# EAGLE design power_supply (EAGLE 9.0.1)
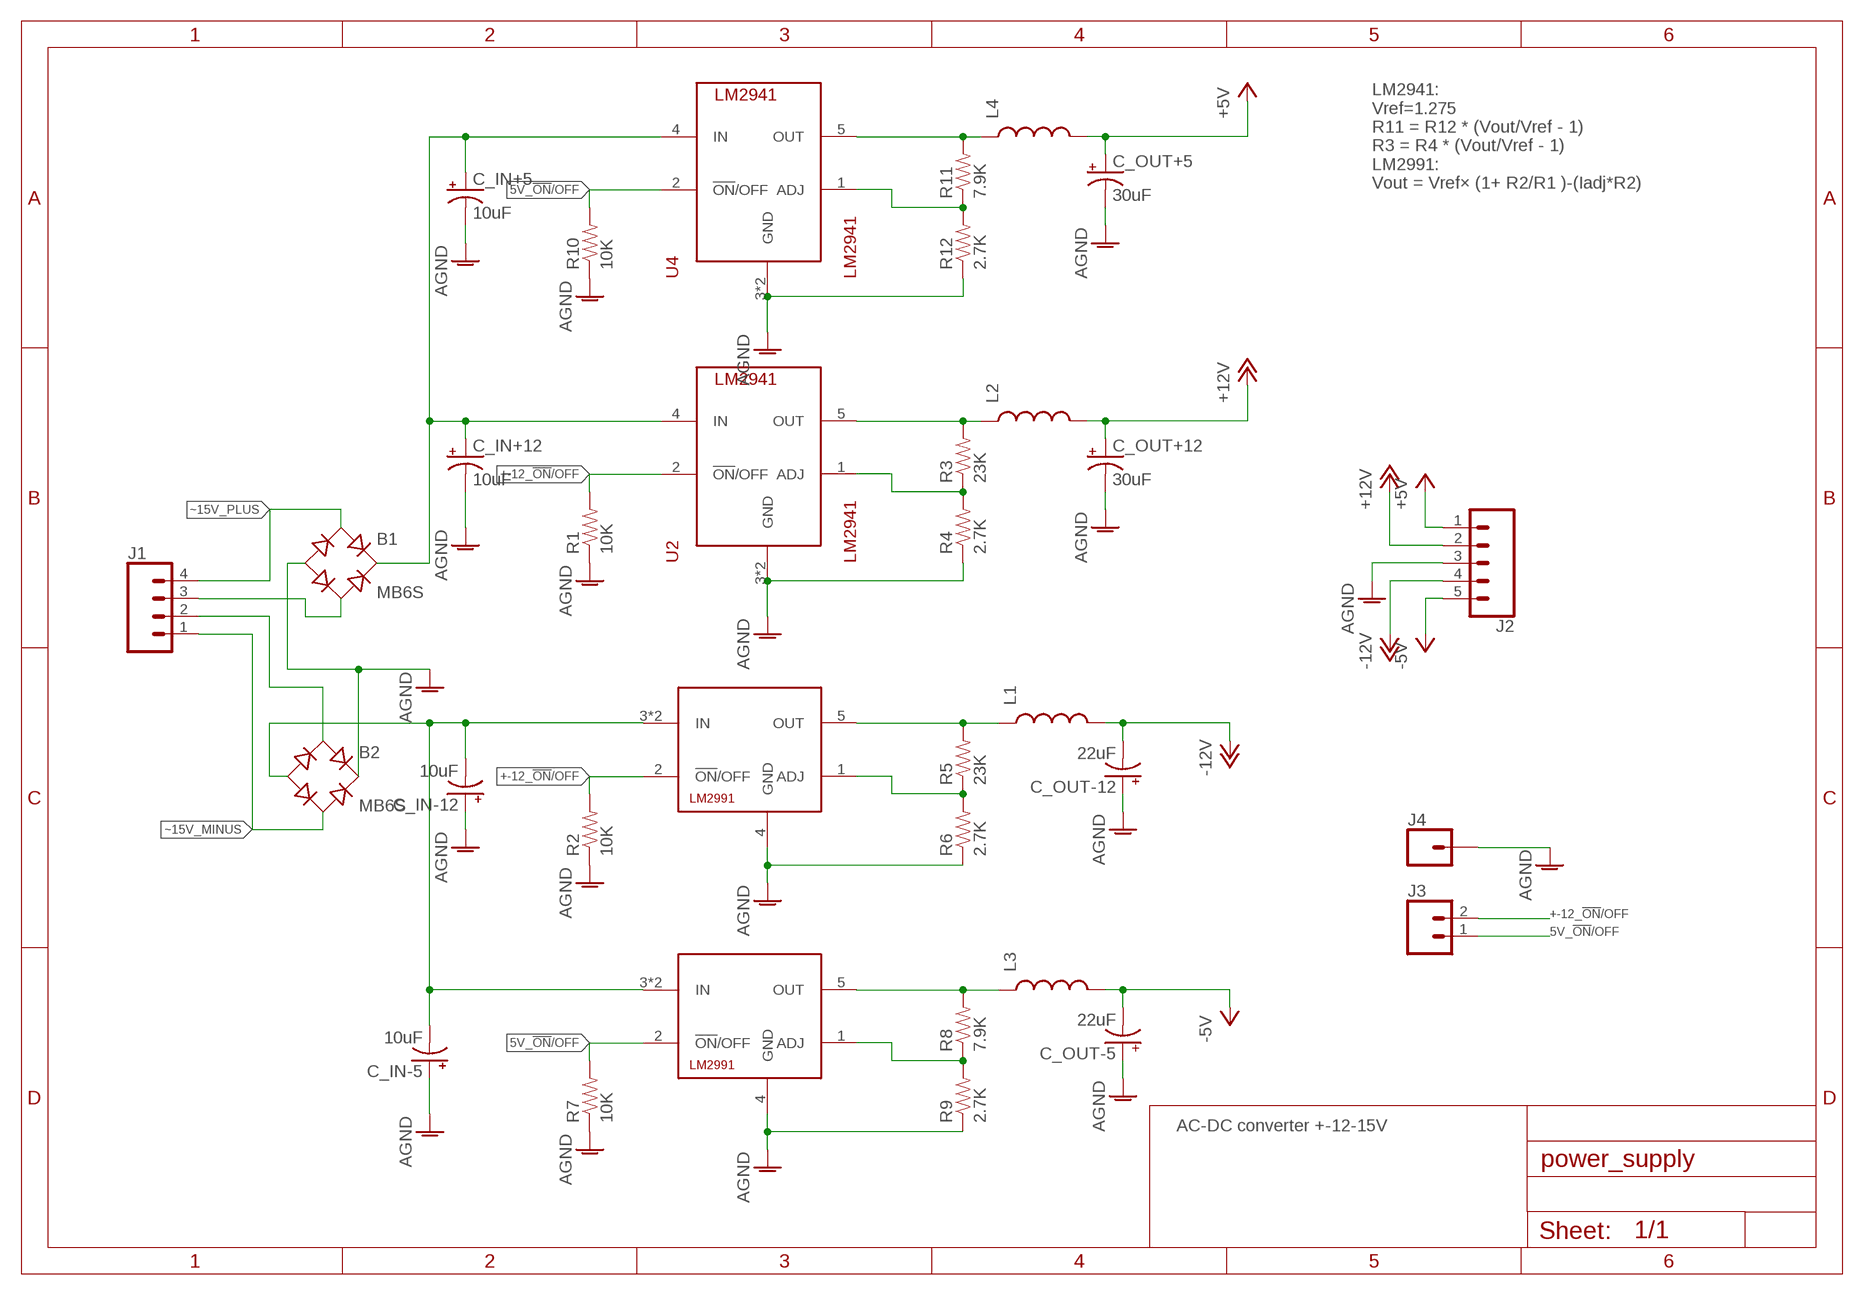
[diagram p0: schematic, sheet 1]

## Parts
B1  MB6S  [SOIC-4]
B2  MB6S  [SOIC-4]
C_IN+5  10uF  CAP_POL1206  [EIA3216]
C_IN+12  10uF  CAP_POL1206  [EIA3216]
C_IN-5  10uF  CAP_POL1206  [EIA3216]
C_IN-12  10uF  CAP_POL1206  [EIA3216]
C_OUT+5  30uF  CAP_POLPTH1  [CPOL-RADIAL-100UF-25V]
C_OUT+12  30uF  CAP_POLPTH1  [CPOL-RADIAL-100UF-25V]
C_OUT-5  22uF  CAP_POLPTH1  [CPOL-RADIAL-100UF-25V]
C_OUT-12  22uF  CAP_POLPTH1  [CPOL-RADIAL-100UF-25V]
J1  CONN_04LONGPADS  [1X04_LONGPADS]
J2  CONN_05PTH_LONGPADS  [1X05_LONGPADS]
J3  CONN_02POLAR  [MOLEX-1X2]
J4  CONN_01  [1X01]
L1  INDUCTOR1206H*  [INDUCTOR-1206]
L2  INDUCTOR1206H*  [INDUCTOR-1206]
L3  INDUCTOR1206H*  [INDUCTOR-1206]
L4  INDUCTOR1206H*  [INDUCTOR-1206]
R1  10K  RESISTOR0805-RES  [0805]
R2  10K  RESISTOR0805-RES  [0805]
R3  23K  RESISTOR0805-RES  [0805]
R4  2.7K  RESISTOR0805-RES  [0805]
R5  23K  RESISTOR0805-RES  [0805]
R6  2.7K  RESISTOR0805-RES  [0805]
R7  10K  RESISTOR0805-RES  [0805]
R8  7.9K  RESISTOR0805-RES  [0805]
R9  2.7K  RESISTOR0805-RES  [0805]
R10  10K  RESISTOR0805-RES  [0805]
R11  7.9K  RESISTOR0805-RES  [0805]
R12  2.7K  RESISTOR0805-RES  [0805]
U1  LM2991  [DDPAK/TO-263]
U2  LM2941  [DDPAK/TO-263]
U3  LM2991  [DDPAK/TO-263]
U4  LM2941  [DDPAK/TO-263]

## Nets
5V_!ON!/OFF: J3.1 R7.2 R10.2 U3.2(!ON!/OFF) U4.2(!ON!/OFF)
+5V: C_OUT+5.1(+) J2.1 L4.P$2
+12V: C_OUT+12.1(+) J2.2 L2.P$2
+-12_!ON!/OFF: J3.2 R1.2 R2.2 U1.2(!ON!/OFF) U2.2(!ON!/OFF)
-5V: C_OUT-5.2(-) J2.5 L3.P$2
-12V: C_OUT-12.2(-) J2.4 L1.P$2
AGND: B1.- B2.+ C_IN+5.C(-) C_IN+12.C(-) C_IN-5.A(+) C_IN-12.A(+) C_OUT+5.2(-) C_OUT+12.2(-) C_OUT-5.1(+) C_OUT-12.1(+) J2.3 J4.1 R1.1 R2.1 R4.1 R6.1 R7.1 R9.1 R10.1 R12.1 U1.4(GND) U2.3(GND) U2.TAB(GND) U3.4(GND) U4.3(GND) U4.TAB(GND)
N$1: B2.- C_IN-5.C(-) C_IN-12.C(-) U1.3(IN) U1.TAB(IN) U3.3(IN) U3.TAB(IN)
N$2: R8.1 R9.2 U3.1(ADJ)
N$3: L3.P$1 R8.2 U3.5(OUT)
N$4: L2.P$1 R3.2 U2.5(OUT)
N$5: B1.+ C_IN+5.A(+) C_IN+12.A(+) U2.4(IN) U4.4(IN)
N$6: B2.~1(AC1) J1.2
N$7: R3.1 R4.2 U2.1(ADJ)
N$8: L1.P$1 R5.2 U1.5(OUT)
N$9: R5.1 R6.2 U1.1(ADJ)
N$10: R11.1 R12.2 U4.1(ADJ)
N$11: L4.P$1 R11.2 U4.5(OUT)
N$13: B1.~2(AC2) J1.3
~15V_MINUS: B2.~2(AC2) J1.1
~15V_PLUS: B1.~1(AC1) J1.4

## Notes on the sheet
- LM2941:
  Vref=1.275
  R11 = R12 * (Vout/Vref - 1)
  R3 = R4 * (Vout/Vref - 1)
  LM2991:
  Vout = Vref× (1+ R2/R1 )-(Iadj*R2)
- AC-DC converter +-12-15V

## Library data of the parts
B1 B2 = rectifier:MB*S: Bridge Rectifier Source: http://www.fairchildsemi.com/ds/MB/MB6S.pdf
C_IN+5 C_IN+12 C_IN-5 C_IN-12 C_OUT+5 C_OUT+12 C_OUT-5 C_OUT-12 = SparkFun-Passives:CAP_POL: Capacitor Polarized These are standard SMD and PTH capacitors. Normally 10uF, 47uF, and 100uF in electrolytic and tantalum varieties. Always verify the external diameter of the through hole cap, it varies with capacity, voltage, and manufacturer. The EIA devices should be standard.
J1 = SparkFun-Connectors:CONN_04: Multi connection point. Often used as Generic Header-pin footprint for 0.1 inch spaced/style header connections On any of the 0.1 inch spaced packages, you can populate with these: Break Away Headers - Straight <https://www.sparkfun.com/products/116> (PRT-00116) Break Away Male Headers - Right Angle <https://www.sparkfun.com/products/553> (PRT-00553) Female Headers <https://www.sparkfun.com/products/115> (PRT-00115) Break Away Headers - Machine Pin <https://www.sparkfun.com/products/117> (PRT-00117) Break Away Female Headers - Swiss Machine Pin <https://www.sparkfun.com/products/743> (PRT-00743) For SCREWTERMINALS and SPRING TERMINALS visit here: Screw Terimnals on SparkFun.com <https://www.sparkfun.com/search/results?term=Screw+Terminals> (5mm/3.5mm/2.54mm spacing) This device is also useful as a general connection point to wire up your design to another part of your project. Our various solder wires solder well into these plated through hole pads. Hook-Up Wire - Assortment (Stranded, 22 AWG) <https://www.sparkfun.com/products/11375> (PRT-11375) Hook-Up Wire - Assortment (Solid Core, 22 AWG) <https://www.sparkfun.com/products/11367> (PRT-11367) View the entire wire category on our website here <https://www.sparkfun.com/categories/141> Special notes: Molex polarized connector foot print use with SKU : PRT-08231 with associated crimp pins and housings. 1MM SMD Version SKU: PRT-10208; PROD_ID: CONN-09696
J2 = SparkFun-Connectors:CONN_05: Multi connection point. Often used as Generic Header-pin footprint for 0.1 inch spaced/style header connections On any of the 0.1 inch spaced packages, you can populate with these: Break Away Headers - Straight <https://www.sparkfun.com/products/116> (PRT-00116) Break Away Male Headers - Right Angle <https://www.sparkfun.com/products/553> (PRT-00553) Female Headers <https://www.sparkfun.com/products/115> (PRT-00115) Break Away Headers - Machine Pin <https://www.sparkfun.com/products/117> (PRT-00117) Break Away Female Headers - Swiss Machine Pin <https://www.sparkfun.com/products/743> (PRT-00743) For SCREWTERMINALS and SPRING TERMINALS visit here: Screw Terimnals on SparkFun.com <https://www.sparkfun.com/search/results?term=Screw+Terminals> (5mm/3.5mm/2.54mm spacing) This device is also useful as a general connection point to wire up your design to another part of your project. Our various solder wires solder well into these plated through hole pads. Hook-Up Wire - Assortment (Stranded, 22 AWG) <https://www.sparkfun.com/products/11375> (PRT-11375) Hook-Up Wire - Assortment (Solid Core, 22 AWG) <https://www.sparkfun.com/products/11367> (PRT-11367) View the entire wire category on our website here <https://www.sparkfun.com/categories/141> Special notes: Molex polarized connector foot print use with SKU : PRT-08231 with associated crimp pins and housings. 1MM SMD Version SKU: PRT-10208
J3 = SparkFun-Connectors:CONN_02: Multi connection point. Often used as Generic Header-pin footprint for 0.1 inch spaced/style header connections On any of the 0.1 inch spaced packages, you can populate with these: Break Away Headers - Straight <https://www.sparkfun.com/products/116> (PRT-00116) Break Away Male Headers - Right Angle <https://www.sparkfun.com/products/553> (PRT-00553) Female Headers <https://www.sparkfun.com/products/115> (PRT-00115) Break Away Headers - Machine Pin <https://www.sparkfun.com/products/117> (PRT-00117) Break Away Female Headers - Swiss Machine Pin <https://www.sparkfun.com/products/743> (PRT-00743) For SCREWTERMINALS and SPRING TERMINALS visit here: Screw Terimnals on SparkFun.com <https://www.sparkfun.com/search/results?term=Screw+Terminals> (5mm/3.5mm/2.54mm spacing) This device is also useful as a general connection point to wire up your design to another part of your project. Our various solder wires solder well into these plated through hole pads. Hook-Up Wire - Assortment (Stranded, 22 AWG) <https://www.sparkfun.com/products/11375> (PRT-11375) Hook-Up Wire - Assortment (Solid Core, 22 AWG) <https://www.sparkfun.com/products/11367> (PRT-11367) View the entire wire category on our website here <https://www.sparkfun.com/categories/141> Special notes: Molex polarized connector foot print use with: PRT-08233 with associated crimp pins and housings. 2.54_SCREWTERM for use with PRT-10571. 3.5mm Screw Terminal footprints for PRT-08084 5mm Screw Terminal footprints for use with PRT-08432; SF_ID: PRT-09918
J4 = SparkFun-Connectors:CONN_01: Single connection point. Often used as Generic Header-pin footprint for 0.1 inch spaced/style header connections On any of the 0.1 inch spaced packages, you can populate with these: Break Away Headers - Straight <https://www.sparkfun.com/products/116> (PRT-00116) Break Away Male Headers - Right Angle <https://www.sparkfun.com/products/553> (PRT-00553) Female Headers <https://www.sparkfun.com/products/115> (PRT-00115) Break Away Headers - Machine Pin <https://www.sparkfun.com/products/117> (PRT-00117) Break Away Female Headers - Swiss Machine Pin <https://www.sparkfun.com/products/743> (PRT-00743) This device is also useful as a general connection point to wire up your design to another part of your project. Our various solder wires solder well into these plated through hole pads. Hook-Up Wire - Assortment (Stranded, 22 AWG) <https://www.sparkfun.com/products/11375> (PRT-11375) Hook-Up Wire - Assortment (Solid Core, 22 AWG) <https://www.sparkfun.com/products/11367> (PRT-11367) View the entire wire category on our website here <https://www.sparkfun.com/categories/141> Special notes: SMTSO-256-ET is a "flush mount" nut for a 4-40 screw. We mostly use this on specialty testbeds; it is a nice way to connect hardware to your PCB at an adjustable hieght. Also note, the SNAP packages are for using a snappable style connector. We sell a baggie of snaps and they are also used on two LilyPad designs: Snap Assortment - 30 pack (male and female) <https://www.sparkfun.com/products/11347> (DEV-11347) LilyPad Arduino SimpleSnap <https://www.sparkfun.com/products/10941> (DEV-10941) LilyPad SimpleSnap Protoboard <https://www.sparkfun.com/products/10940> (DEV-10940)
L1-L4 = SparkFun-Passives:INDUCTOR: Inductors Basic Inductor/Choke - 0603 and 1206. Footprints are not proven and vary greatly between part numbers. INDUCTOR POWER 3.3UH 4.0A SMD 0.197" L x 0.197" W x 0.177" H (5.00mm x 5.00mm x 4.50mm)
R1-R12 = SparkFun-Passives:RESISTOR: Resistor Basic schematic elements and footprints for 0603, 1206, and PTH resistors.
U1 U3 = EduAreaLib:LM2991
U2 U4 = EduAreaLib:LM2941

## Board
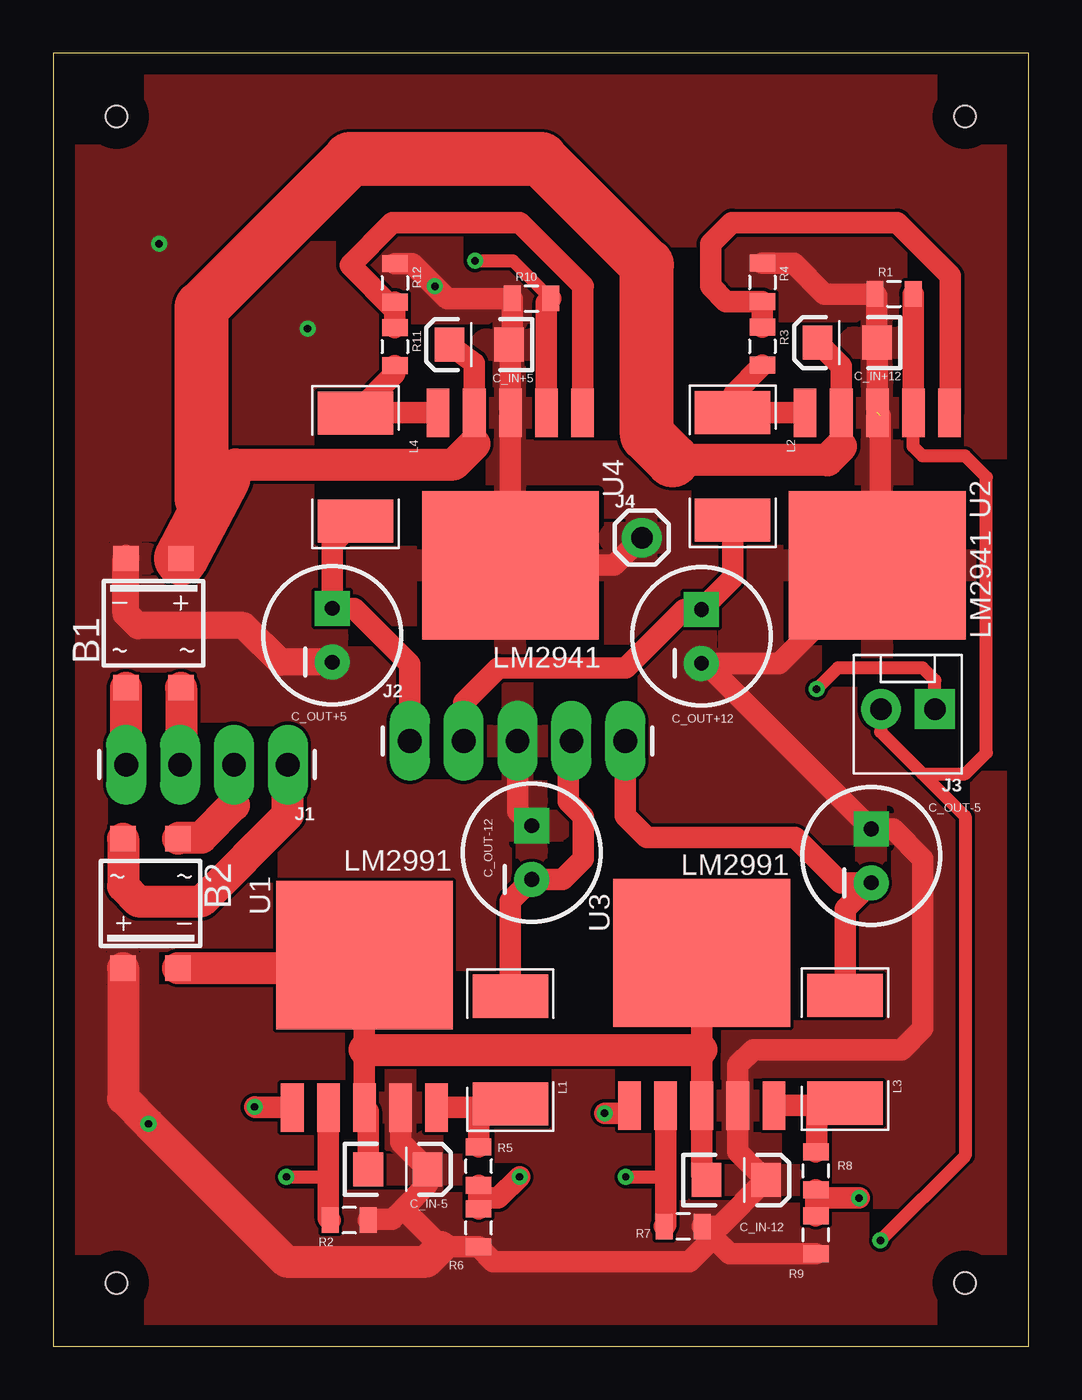
[diagram p1: board, top side]
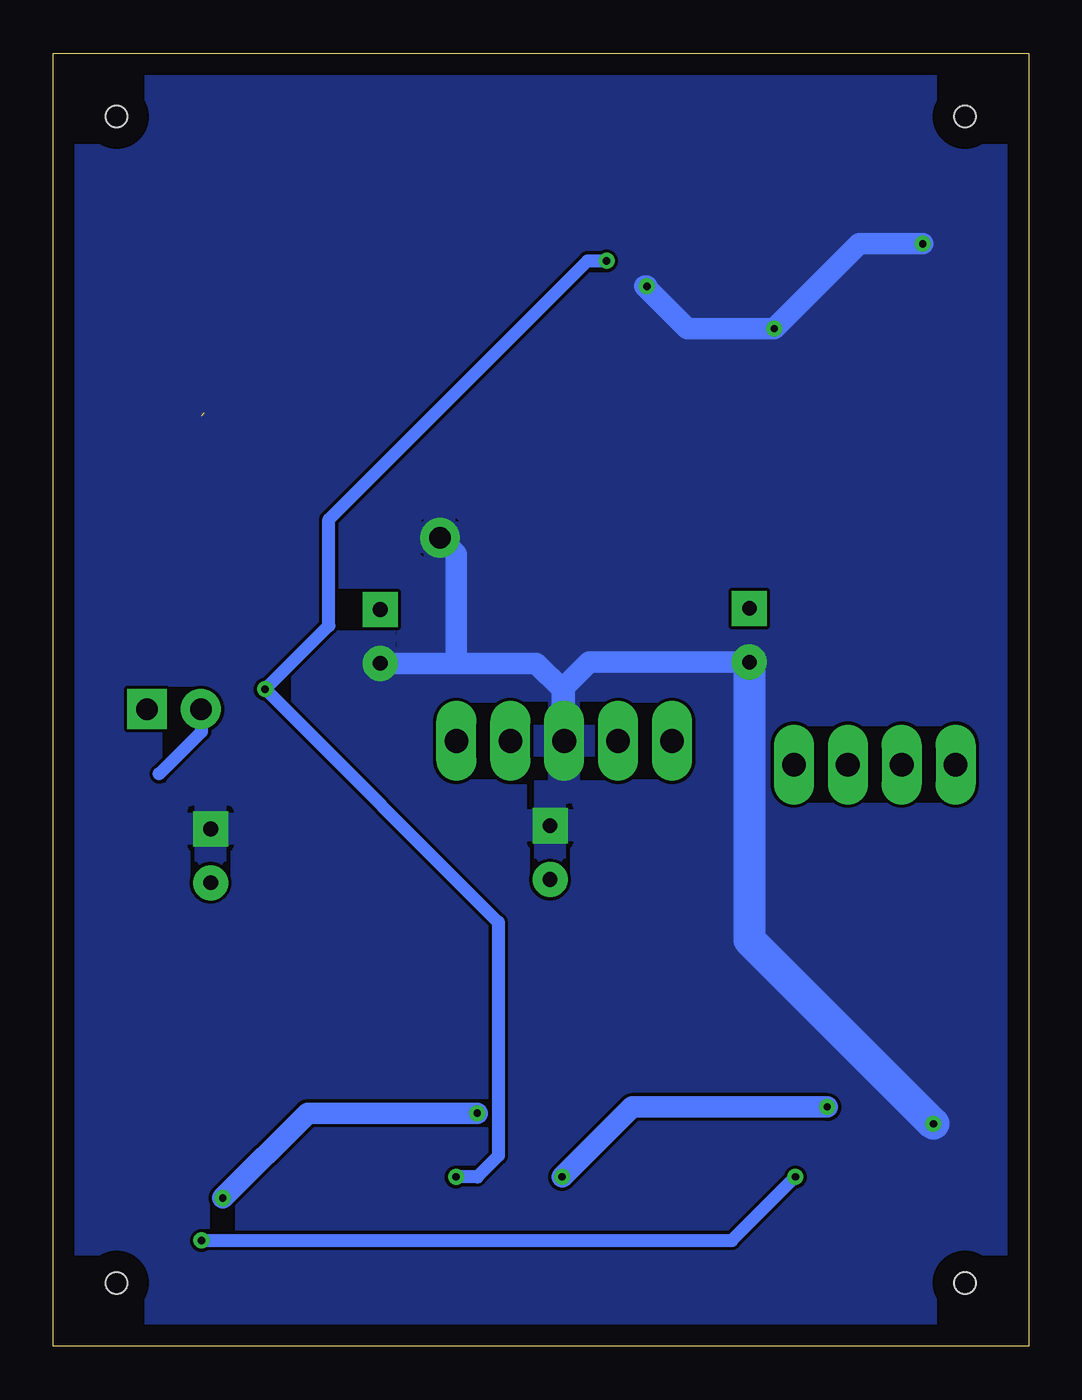
[diagram p2: board, bottom side, seen from below]

Size 46 x 61 mm. Coordinates in mm from the lower left corner, seen from the top.
Outline: 0,0 46,0 46,61 0,61 0,0
Copper layers (1*16): Top 0.035mm / dielectric 1.5mm / Bottom 0.035mm
Design rules "default": minimum track width 6mil, minimum drill 0.35mm, track to track 6mil, track to pad 6mil, pad to pad 6mil, via to via 6mil, smd to smd 6mil, copper to edge 40mil, drill to drill 6mil, minimum pad ring 10mil, minimum via ring 8mil, stop-mask expansion 4mil, vias tented up to drill 0mil, thermal gap 10mil
Holes 1 mm at 3,3 43,3 43,58 3,58

### Footprints (pad centres in the part's own frame; a part is rotated, then mirrored left to right if it is on the bottom)
SOIC-4 = smd 1.2 x 1.2: + 1.3,3.05; - -1.3,3.05; ~1 -1.3,-3.05; ~2 1.3,-3.05
EIA3216 = smd 1.4 x 1.6: A 1.4,0; C -1.4,0
CPOL-RADIAL-100UF-25V = drill 0.7 pad 1.651 square: 1 1.27,0 | drill 0.7 pad 1.651: 2 -1.27,0
1X04_LONGPADS = drill 1.118 pad 1.88 long: 1 0,0; 2 2.54,0; 3 5.08,0; 4 7.62,0
1X05_LONGPADS = drill 1.118 pad 1.88 long: 1 0,0; 2 2.54,0; 3 5.08,0; 4 7.62,0; 5 10.16,0
MOLEX-1X2 = drill 1.016 pad 1.88 square: 1 0,0 | drill 1.016 pad 1.88: 2 2.54,0
1X01 = drill 1.016 pad 1.88: 1 0,0
INDUCTOR-1206 = smd 2.032 x 3.556: P$1 -2.54,0; P$2 2.54,0
0805 = smd 0.8 x 1.2: 1 -0.9,0; 2 0.9,0
DDPAK/TO-263 = smd 1.067 x 2.286: 1 -3.404,0; 2 -1.702,0; 3 0,0; 4 1.702,0; 5 3.404,0 | smd 8.331 x 6.985: TAB 0,7.188

### Placement (x,y rotation side)
B1  4.74,34.11 0 top
B2  4.6,20.9 180 top
C_IN+5  20.09,47.25 180 top
C_IN+12  37.44,47.35 180 top
C_IN-5  16.26,8.35 0 top
C_IN-12  32.21,7.85 0 top
C_OUT+5  13.17,33.54 90 top
C_OUT+12  30.57,33.49 90 top
C_OUT-5  38.57,23.14 90 top
C_OUT-12  22.57,23.29 90 top
J1  11.07,27.44 180 top
J2  16.82,28.56 0 top
J3  41.57,30.06 180 top
J4  27.76,38.14 0 top
L1  21.56,13.98 90 top
L2  32.04,41.51 270 top
L3  37.34,14.02 90 top
L4  14.26,41.47 270 top
R1  39.65,49.64 0 top
R2  13.96,5.96 180 top
R3  33.44,47.17 270 top
R4  33.44,50.18 270 top
R5  20.06,8.51 90 top
R6  20.06,5.6 90 top
R7  29.71,5.66 180 top
R8  35.96,8.28 90 top
R9  35.96,5.27 90 top
R10  22.56,49.42 0 top
R11  16.12,47.15 270 top
R12  16.12,50.16 270 top
U1  14.68,11.27 0 top
U2  38.86,44.03 180 top
U3  30.58,11.37 0 top
U4  21.56,44.03 180 top

### Tracks (layer width: path | path; a pad name or v marks a point on that pad's centre or on a via)
5V_!ON!/OFF  (via drill 0.35)
  Top 0.61: J3.1 41.57,31.43 41,32 37,32 v36,31 | v19.9,51.2 21.68,51.2 R10.2 | v27,8 28.88,8
  Top 1.016: U4.2 23.26,49.22 R10.2 | R7.2 28.88,5.73 28.88,8 U3.2
  Bottom 0.61: v27,8 26,8 25,9 25,20 v36,31 33,34 33,39 20.8,51.2 v19.9,51.2
+5V
  Top 1.016: J2.1 16.82,32.18 14.19,34.81 C_OUT+5.1 13.17,37.84 L4.P$2
+12V
  Top 1.016: J2.2 19.36,30.36 21,32 27,32 29.76,34.76 C_OUT+12.1 32.04,36.23 L2.P$2
+-12_!ON!/OFF  (via drill 0.35)
  Top 0.61: 40.55,44.04 40.55,42.45 41,42 43,42 44,41 44,28 43,27 41,27 39,29 39.03,29.03 J3.2 39.03,28.97 43,25 43,9 v39,5 | v11,8 12.98,8
  Top 1.016: R1.2 40.55,44.04 U2.2 | R2.2 12.98,6.04 12.98,8 U1.2
  Bottom 0.61: 41,27 39,29 39,30.03 J3.2 | v39,5 14,5 v11,8
-5V
  Top 1.016: J2.5 26.98,25.02 28,24 35,24 37.13,21.87 C_OUT-5.2 37.34,20.64 L3.P$2
-12V
  Top 1.016: J2.4 24.3,28.42 24.3,25.7 25,25 25,23 24.02,22.02 C_OUT-12.2 21.56,21.01 L1.P$2
AGND  (via drill 0.35)  (1 unrouted)
  Top 1.016: C_OUT-12.1 21.9,25.23 J2.3 | 39,43.89 39,36.98 U2.TAB 34.24,32.22 C_OUT+12.2 30.76,32.22 C_OUT-5.1 39.6,24.4 41,23 41,15 40,14 33,14 32.28,13.28 U3.4 32.28,9.18 C_IN-12.A 31.42,5.66 R7.1 31.14,5.13 | J4.1 26.46,36.84 U4.TAB 21.16,36.84 21,37 21.56,37.56 U4.3 21.56,47.02 21.66,47.12 | 21.66,47.12 C_IN+5.C | 21.66,47.12 R10.1 18.58,49.42 v18,50 16.94,51.06 R12.1 | U2.3 38.86,47.33 C_IN+12.C 38.84,49.55 R1.1 36.36,49.64 34.92,51.08 R4.1 | U1.4 16.38,9.63 C_IN-5.A 17.66,7.66 16.5,6.5 | R2.1 14.9,6 16,6 16.5,6.5 | 16.5,6.5 18.3,4.7 R6.1 20.76,4 30,4 31.14,5.13 | R9.1 31.9,4.37 31.14,5.13
  Top 1.27: C_OUT+5.2 10.73,32.27 9,34 4,34 3.44,34.56 B1.-
  Top 1.5: B2.+ 3.3,11.7 v4.5,10.5 11,4 17.6,4 18.3,4.7
  Bottom 1.016: C_OUT+12.2 27,32.22 | 27,32.22 23.22,32.22 22,31 22,28.66 J2.3 21.9,31.1 20.73,32.27 C_OUT+5.2 | J4.1 27,37.38 27,32.22 | v5,52 8,52 v12,48 16.1,48 18.1,50 v18,50
  Bottom 1.5: C_OUT+5.2 13.17,19.17 v4.5,10.5
  pour Bottom: 0,61 46,61 46,0 0,0
  pour Top: 0,61 46,61 46,0 0,0
N$1
  Top 1.016: 30.56,18.56 U3.TAB 30.58,14 U3.3 30.58,8.08 C_IN-12.C | 14.68,18.34 U1.TAB 14.68,17 14.68,14 U1.3 14.86,11.09 C_IN-5.C
  Top 1.5: 14.68,14 30.58,14 | B2.- 13.83,17.85 14.68,17
N$2  (via drill 0.35)
  Top 1.016: R9.2 R8.1 36.34,7 v38,7 | U3.1 26.81,11 v26,11
  Bottom 1.016: v26,11 34,11 v38,7
N$3
  Top 1.016: U3.5 36,11.37 | 36,11.37 37.23,11.37 L3.P$1 | R8.2 36,9.22 36,11.37
N$4
  Top 1.016: 32.09,44 33,44 33.03,44.03 U2.5 35.44,44.05 | 32.09,44 L2.P$1 | R3.2 32.09,44.92 32.09,44
N$5
  Top 1.016: 19.86,42.56 U4.4 19.86,46.38 C_IN+5.A | 37.16,42.46 U2.4 37.16,46.23 C_IN+12.A | 29.2,41.8 29,42 | 7.04,39.96 7,40 8,41 8.6,41.6
  Top 1.5: 8.6,41.6 18.9,41.6 19.86,42.56 | 37.16,42.46 36.5,41.8 29.2,41.8
  Top 2.54: 29.2,41.8 28,43 28,51 23,56 14,56 7,49 7,40 | B1.+ 8.04,40.96 8,41
N$6
  Top 1.27: 8.53,25.53 J1.2
  Top 1.5: B2.~1 5.95,24 7,24 8.53,25.53
N$7
  Top 1.016: U2.1 42.3,44.07 42.3,50.5 39.8,53 32,53 31,52 31,50 31.72,49.28 R4.2 R3.1
N$8
  Top 1.016: U1.5 20,11.27 | 20,11.27 21.39,11.27 L1.P$1 | R5.2 20.06,11.21 20,11.27
N$9  (via drill 0.35)
  Top 1.016: R6.2 20.06,7 | 20.06,7 R5.1 | U1.1 9.53,11.27 v9.5,11.3 | v22,8 21,7 20.06,7
  Bottom 1.016: v9.5,11.3 18.7,11.3 v22,8
N$10
  Top 1.016: R12.2 R11.1 16.12,48.88 14,51 16,53 22,53 25,50 24.96,49.96 U4.1
N$11
  Top 1.016: 18.12,44.07 U4.5 14.28,44.03 L4.P$1 16.12,45.87 R11.2
N$13
  Top 1.27: 6.04,27.49 J1.3
  Top 1.5: B1.~2 6.04,27.49
~15V_MINUS
  Top 1.5: B2.~2 3.3,21.7 4,21 7,21 11.07,25.07 J1.1
~15V_PLUS
  Top 1.27: J1.4
  Top 1.5: B1.~1 J1.4